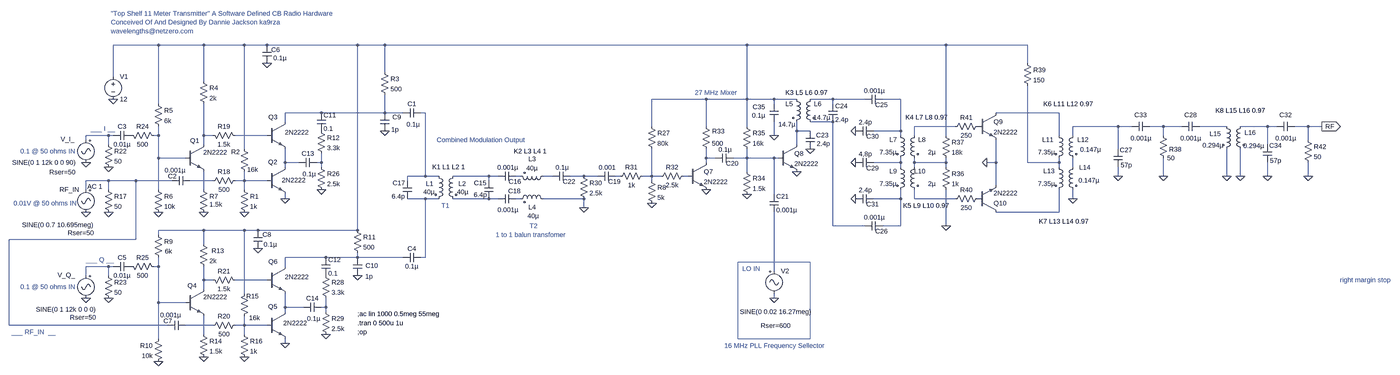
[diagram p0: schematic Top Shelf Transmitter.asc, whole sheet]
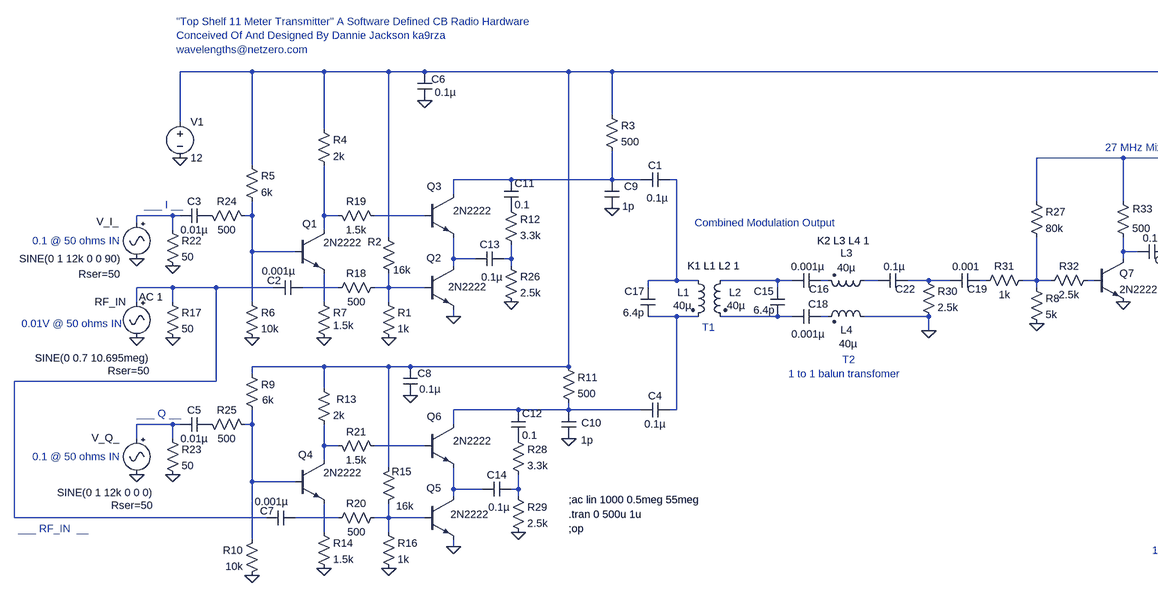
[diagram p1: schematic Top Shelf Transmitter.asc, part, row 1 of 1, column 1 of 2]
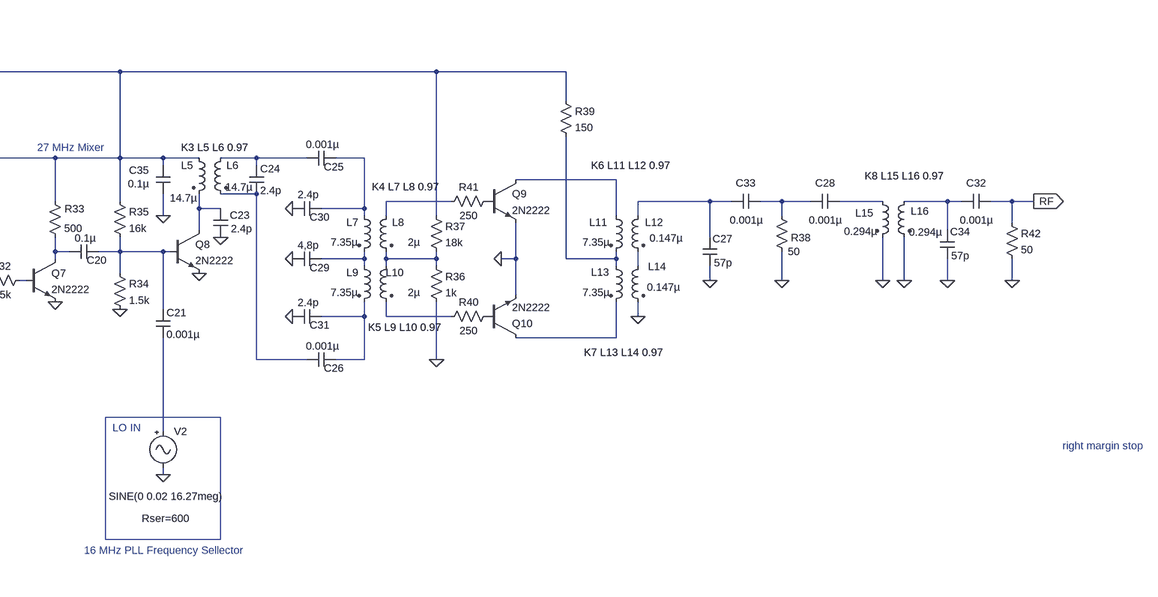
[diagram p2: schematic Top Shelf Transmitter.asc, part, row 1 of 1, column 2 of 2]
Top Shelf Transmitter.asc, the LTspice schematic file:
Version 4
SHEET 1 4188 1556
WIRE -192 352 -352 352
WIRE -32 352 -192 352
WIRE 112 352 -32 352
WIRE 192 352 112 352
WIRE 512 352 192 352
WIRE 608 352 512 352
WIRE 1888 352 608 352
WIRE 2592 352 1888 352
WIRE 2880 352 2592 352
WIRE 2880 416 2880 352
WIRE 608 448 608 352
WIRE -352 464 -352 352
WIRE -32 480 -32 352
WIRE 1744 544 1552 544
WIRE 1888 544 1888 352
WIRE 1888 544 1744 544
WIRE 1984 544 1888 544
WIRE 2064 544 1984 544
WIRE 2192 544 2112 544
WIRE 2304 544 2192 544
WIRE 2432 544 2368 544
WIRE -192 560 -192 352
WIRE 1984 560 1984 544
WIRE 2192 560 2192 544
WIRE 384 592 256 592
WIRE 608 592 608 528
WIRE 608 592 384 592
WIRE 672 592 608 592
WIRE 752 592 736 592
WIRE 2992 592 2768 592
WIRE 256 624 256 592
WIRE 2192 624 2112 624
WIRE 1552 640 1552 544
WIRE 1744 640 1744 544
WIRE 1888 640 1888 544
WIRE 2624 640 2480 640
WIRE 3200 640 3040 640
WIRE 3248 640 3200 640
WIRE 3360 640 3312 640
WIRE 3424 640 3360 640
WIRE 3584 640 3488 640
WIRE 3728 640 3632 640
WIRE 3760 640 3728 640
WIRE 3872 640 3824 640
WIRE 3920 640 3872 640
WIRE 2064 656 2064 624
WIRE 2112 656 2064 656
WIRE 2432 656 2432 544
WIRE 2432 656 2336 656
WIRE -368 672 -448 672
WIRE -352 672 -368 672
WIRE -192 672 -192 640
WIRE -192 672 -208 672
WIRE -32 672 -32 560
WIRE 0 672 -32 672
WIRE 192 672 80 672
WIRE 1984 672 1984 624
WIRE 2432 672 2432 656
WIRE 2480 672 2480 640
WIRE 2592 672 2592 352
WIRE 2992 672 2992 592
WIRE 3040 672 3040 640
WIRE 3360 672 3360 640
WIRE -448 688 -448 672
WIRE 3872 688 3872 640
WIRE -368 704 -368 672
WIRE -32 704 -32 672
WIRE 2064 704 2064 656
WIRE 3728 704 3728 640
WIRE 112 720 112 352
WIRE 3200 720 3200 640
WIRE -192 752 -192 672
WIRE -96 752 -192 752
WIRE 1744 752 1744 720
WIRE 1776 752 1744 752
WIRE 1888 752 1888 720
WIRE 1888 752 1840 752
WIRE 1984 752 1888 752
WIRE 2000 752 1984 752
WIRE 256 768 256 720
WIRE 304 768 256 768
WIRE 384 768 384 736
WIRE 384 768 368 768
WIRE 1744 768 1744 752
WIRE 2288 768 2272 768
WIRE 2432 768 2432 752
WIRE 2432 768 2336 768
WIRE 2480 768 2480 752
WIRE 2592 768 2592 752
WIRE 2592 768 2480 768
WIRE 2768 768 2768 688
WIRE 2768 768 2736 768
WIRE 2880 768 2880 496
WIRE 2992 768 2992 752
WIRE 2992 768 2880 768
WIRE 256 784 256 768
WIRE 384 784 384 768
WIRE 2432 784 2432 768
WIRE 2480 784 2480 768
WIRE 2592 784 2592 768
WIRE 2992 784 2992 768
WIRE 3040 784 3040 752
WIRE 1888 800 1888 752
WIRE 752 816 752 592
WIRE 752 816 688 816
WIRE 800 816 752 816
WIRE 976 816 848 816
WIRE 1008 816 976 816
WIRE 1088 816 1072 816
WIRE 1200 816 1168 816
WIRE 1312 816 1264 816
WIRE 1360 816 1312 816
WIRE 1440 816 1424 816
WIRE 1552 816 1552 720
WIRE 1552 816 1520 816
WIRE 1584 816 1552 816
WIRE 1680 816 1664 816
WIRE 3200 816 3200 784
WIRE 3360 816 3360 752
WIRE 3584 816 3584 720
WIRE 3632 816 3632 720
WIRE 3728 816 3728 768
WIRE 3872 816 3872 768
WIRE -368 832 -448 832
WIRE -272 832 -368 832
WIRE -144 832 -272 832
WIRE 0 832 -80 832
WIRE 112 832 112 800
WIRE 112 832 80 832
WIRE 192 832 112 832
WIRE 688 832 688 816
WIRE 976 832 976 816
WIRE 1552 832 1552 816
WIRE 2768 848 2768 768
WIRE -448 864 -448 832
WIRE -368 864 -368 832
WIRE -192 864 -192 752
WIRE -32 864 -32 800
WIRE 112 864 112 832
WIRE 1984 880 1984 752
WIRE 256 896 256 880
WIRE 752 896 688 896
WIRE 800 896 752 896
WIRE 976 896 976 880
WIRE 976 896 848 896
WIRE 1008 896 976 896
WIRE 1088 896 1072 896
WIRE 1312 896 1168 896
WIRE 2432 896 2432 864
WIRE 2432 896 2336 896
WIRE 2480 896 2480 864
WIRE 2624 896 2480 896
WIRE 3040 896 3040 864
WIRE 1312 928 1312 896
WIRE 2992 944 2992 864
WIRE 2992 944 2768 944
WIRE 2192 992 2192 624
WIRE 2304 992 2192 992
WIRE 2432 992 2432 896
WIRE 2432 992 2368 992
WIRE 2592 992 2592 864
WIRE -32 1008 -192 1008
WIRE 112 1008 -32 1008
WIRE 160 1008 112 1008
WIRE 512 1008 512 352
WIRE 512 1008 160 1008
WIRE -192 1024 -192 1008
WIRE -272 1040 -272 832
WIRE -272 1040 -720 1040
WIRE -32 1056 -32 1008
WIRE 400 1104 256 1104
WIRE 512 1104 512 1088
WIRE 512 1104 400 1104
WIRE 672 1104 512 1104
WIRE 752 1104 752 896
WIRE 752 1104 736 1104
WIRE -368 1136 -448 1136
WIRE -352 1136 -368 1136
WIRE -192 1136 -192 1104
WIRE -192 1136 -208 1136
WIRE 256 1136 256 1104
WIRE 1984 1152 1984 944
WIRE -448 1168 -448 1136
WIRE -368 1168 -368 1136
WIRE -32 1184 -32 1136
WIRE 0 1184 -32 1184
WIRE 192 1184 80 1184
WIRE -32 1216 -32 1184
WIRE 112 1232 112 1008
WIRE 1984 1248 1984 1232
WIRE -192 1264 -192 1136
WIRE -96 1264 -192 1264
WIRE 256 1280 256 1232
WIRE 320 1280 256 1280
WIRE 400 1280 400 1248
WIRE 400 1280 384 1280
WIRE 256 1296 256 1280
WIRE 400 1296 400 1280
WIRE -720 1344 -720 1040
WIRE -160 1344 -720 1344
WIRE 0 1344 -96 1344
WIRE 112 1344 112 1312
WIRE 112 1344 80 1344
WIRE 192 1344 112 1344
WIRE -32 1376 -32 1312
WIRE 112 1376 112 1344
WIRE -192 1392 -192 1264
WIRE 256 1408 256 1392
FLAG 256 896 0
FLAG 3920 640 RF
IOPIN 3920 640 Out
FLAG -352 544 0
FLAG -448 768 0
FLAG -448 944 0
FLAG -192 944 0
FLAG -32 944 0
FLAG 256 1408 0
FLAG -448 1248 0
FLAG -32 1456 0
FLAG 192 416 0
FLAG -192 1472 0
FLAG 112 944 0
FLAG 112 1456 0
FLAG -368 944 0
FLAG -368 784 0
FLAG -368 1248 0
FLAG 160 1072 0
FLAG 608 656 0
FLAG 512 1168 0
FLAG 1312 928 0
FLAG 400 1376 0
FLAG 384 864 0
FLAG 1552 912 0
FLAG 1744 864 0
FLAG 1888 880 0
FLAG 2064 800 0
FLAG 1984 1248 0
FLAG 2272 768 0
FLAG 2736 768 0
FLAG 2592 992 0
FLAG 3360 816 0
FLAG 2272 896 0
FLAG 2272 656 0
FLAG 3040 896 0
FLAG 3200 816 0
FLAG 3584 816 0
FLAG 3632 816 0
FLAG 3872 816 0
FLAG 3728 816 0
FLAG 2112 720 0
FLAG 1984 672 0
SYMBOL npn 192 784 R0
WINDOW 0 4 -18 Left 0
WINDOW 3 52 46 Left 0
SYMATTR InstName Q2
SYMATTR Value 2N2222
SYMBOL npn 192 624 R0
WINDOW 0 5 -17 Left 0
WINDOW 3 63 37 Left 0
SYMATTR InstName Q3
SYMATTR Value 2N2222
SYMBOL res 96 848 R0
SYMATTR InstName R1
SYMATTR Value 1k
SYMBOL res 96 704 R0
WINDOW 0 -31 26 Left 0
WINDOW 3 26 89 Left 0
SYMATTR InstName R2
SYMATTR Value 16k
SYMBOL res 592 432 R0
SYMATTR InstName R3
SYMATTR Value 500
SYMBOL cap 736 576 R90
WINDOW 0 0 32 VBottom 0
WINDOW 3 41 27 VTop 0
SYMATTR InstName C1
SYMATTR Value 0.1µ
SYMBOL voltage -352 448 R0
WINDOW 123 0 0 Left 0
WINDOW 39 0 0 Left 0
SYMATTR InstName V1
SYMATTR Value 12
SYMBOL cap -288 656 R90
WINDOW 0 0 32 VBottom 0
WINDOW 3 32 32 VTop 0
SYMATTR InstName C3
SYMATTR Value 0.01µ
SYMBOL npn -96 704 R0
WINDOW 0 16 -14 Left 0
WINDOW 3 63 28 Left 0
SYMATTR InstName Q1
SYMATTR Value 2N2222
SYMBOL res -48 464 R0
SYMATTR InstName R4
SYMATTR Value 2k
SYMBOL res -208 544 R0
SYMATTR InstName R5
SYMATTR Value 6k
SYMBOL res -208 848 R0
SYMATTR InstName R6
SYMATTR Value 10k
SYMBOL res -48 848 R0
WINDOW 3 36 68 Left 0
SYMATTR Value 1.5k
SYMATTR InstName R7
SYMBOL npn 192 1296 R0
WINDOW 0 4 -18 Left 0
WINDOW 3 57 40 Left 0
SYMATTR InstName Q5
SYMATTR Value 2N2222
SYMBOL npn 192 1136 R0
WINDOW 0 5 -17 Left 0
WINDOW 3 63 37 Left 0
SYMATTR InstName Q6
SYMATTR Value 2N2222
SYMBOL res 496 992 R0
SYMATTR InstName R11
SYMATTR Value 500
SYMBOL cap 736 1088 R90
WINDOW 0 0 32 VBottom 0
WINDOW 3 32 32 VTop 0
SYMATTR InstName C4
SYMATTR Value 0.1µ
SYMBOL cap -288 1120 R90
WINDOW 0 0 32 VBottom 0
WINDOW 3 32 32 VTop 0
SYMATTR InstName C5
SYMATTR Value 0.01µ
SYMBOL npn -96 1216 R0
WINDOW 0 7 -12 Left 0
WINDOW 3 63 28 Left 0
SYMATTR InstName Q4
SYMATTR Value 2N2222
SYMBOL res -48 1040 R0
WINDOW 0 44 40 Left 0
SYMATTR InstName R13
SYMATTR Value 2k
SYMBOL res -48 1360 R0
SYMATTR InstName R14
SYMATTR Value 1.5k
SYMBOL cap 176 352 R0
WINDOW 0 31 17 Left 0
WINDOW 3 38 46 Left 0
SYMATTR InstName C6
SYMATTR Value 0.1µ
SYMBOL Misc\\signal -448 672 M0
WINDOW 0 40 13 Left 0
WINDOW 3 35 96 Left 0
WINDOW 123 0 0 Left 0
WINDOW 39 37 130 Left 0
SYMATTR InstName V_I_
SYMATTR Value SINE(0 1 12k 0 0 90)
SYMATTR SpiceLine Rser=50
SYMBOL Misc\\signal -448 848 M0
WINDOW 3 -28 141 Left 0
WINDOW 123 -58 5 Left 0
WINDOW 39 -28 169 Left 0
SYMATTR Value SINE(0 0.7 10.695meg)
SYMATTR Value2 AC 1
SYMATTR SpiceLine Rser=50
SYMATTR InstName RF_IN
SYMBOL Misc\\signal -448 1152 M0
WINDOW 0 39 14 Left 0
WINDOW 3 -35 136 Left 0
WINDOW 123 0 0 Left 0
WINDOW 39 -35 164 Left 0
SYMATTR InstName V_Q_
SYMATTR Value SINE(0 1 12k 0 0 0)
SYMATTR SpiceLine Rser=50
SYMBOL res -208 1008 R0
WINDOW 3 39 74 Left 0
SYMATTR Value 6k
SYMATTR InstName R9
SYMBOL res -176 1376 M0
SYMATTR InstName R10
SYMATTR Value 10k
SYMBOL res 128 1216 M0
WINDOW 0 -35 25 Left 0
WINDOW 3 -39 102 Left 0
SYMATTR InstName R15
SYMATTR Value 16k
SYMBOL res 96 1360 R0
SYMATTR InstName R16
SYMATTR Value 1k
SYMBOL cap -96 1328 R90
WINDOW 0 16 63 VBottom 0
WINDOW 3 -36 53 VTop 0
SYMATTR InstName C7
SYMATTR Value 0.001µ
SYMBOL res 96 1328 R90
WINDOW 0 0 56 VBottom 0
WINDOW 3 32 56 VTop 0
SYMATTR InstName R20
SYMATTR Value 500
SYMBOL res 96 816 R90
WINDOW 0 0 56 VBottom 0
WINDOW 3 32 56 VTop 0
SYMATTR InstName R18
SYMATTR Value 500
SYMBOL res -384 848 R0
SYMATTR InstName R17
SYMATTR Value 50
SYMBOL cap -80 816 R90
WINDOW 0 16 63 VBottom 0
WINDOW 3 -36 53 VTop 0
SYMATTR InstName C2
SYMATTR Value 0.001µ
SYMBOL res 96 688 M270
WINDOW 0 32 56 VTop 0
WINDOW 3 0 56 VBottom 0
SYMATTR InstName R19
SYMATTR Value 1.5k
SYMBOL res 96 1200 M270
WINDOW 0 32 56 VTop 0
WINDOW 3 0 56 VBottom 0
SYMATTR InstName R21
SYMATTR Value 1.5k
SYMBOL res -384 688 R0
SYMATTR InstName R22
SYMATTR Value 50
SYMBOL res -384 1152 R0
SYMATTR InstName R23
SYMATTR Value 50
SYMBOL res -192 688 M270
WINDOW 0 32 56 VTop 0
WINDOW 3 0 56 VBottom 0
SYMATTR InstName R24
SYMATTR Value 500
SYMBOL res -192 1152 M270
WINDOW 0 32 56 VTop 0
WINDOW 3 0 56 VBottom 0
SYMATTR InstName R25
SYMATTR Value 500
SYMBOL cap 144 1008 R0
WINDOW 0 32 15 Left 0
WINDOW 3 36 50 Left 0
SYMATTR InstName C8
SYMATTR Value 0.1µ
SYMBOL cap 496 1104 R0
WINDOW 0 44 29 Left 0
WINDOW 3 43 67 Left 0
SYMATTR InstName C10
SYMATTR Value 1p
SYMBOL cap 592 592 R0
WINDOW 0 43 15 Left 0
WINDOW 3 39 59 Left 0
SYMATTR InstName C9
SYMATTR Value 1p
SYMBOL ind2 784 800 R0
WINDOW 0 -31 43 Left 0
WINDOW 3 -40 72 Left 0
SYMATTR InstName L1
SYMATTR Value 40µ
SYMATTR Type ind
SYMBOL ind2 864 800 M0
WINDOW 0 -31 43 Left 0
WINDOW 3 -40 72 Left 0
SYMATTR InstName L2
SYMATTR Value 40µ
SYMATTR Type ind
SYMBOL cap 368 592 R0
SYMATTR InstName C11
SYMATTR Value 0.1
SYMBOL cap 384 1104 R0
SYMATTR InstName C12
SYMATTR Value 0.1
SYMBOL res 368 640 R0
SYMATTR InstName R12
SYMATTR Value 3.3k
SYMBOL res 368 768 R0
SYMATTR InstName R26
SYMATTR Value 2.5k
SYMBOL res 384 1152 R0
SYMATTR InstName R28
SYMATTR Value 3.3k
SYMBOL res 384 1280 R0
SYMATTR InstName R29
SYMATTR Value 2.5k
SYMBOL cap 368 752 R90
WINDOW 0 0 32 VBottom 0
WINDOW 3 41 27 VTop 0
SYMATTR InstName C13
SYMATTR Value 0.1µ
SYMBOL cap 384 1264 R90
WINDOW 0 0 32 VBottom 0
WINDOW 3 41 27 VTop 0
SYMATTR InstName C14
SYMATTR Value 0.1µ
SYMBOL cap 704 832 M0
SYMATTR InstName C17
SYMATTR Value 6.4p
SYMBOL cap 992 832 M0
WINDOW 3 22 50 Left 0
SYMATTR Value 6.4p
SYMATTR InstName C15
SYMBOL cap 1072 800 R90
WINDOW 0 51 4 VBottom 0
WINDOW 3 -30 29 VTop 0
SYMATTR InstName C16
SYMATTR Value 0.001µ
SYMBOL ind2 1184 800 R90
WINDOW 0 -29 55 VBottom 0
WINDOW 3 -28 55 VTop 0
SYMATTR InstName L3
SYMATTR Value 40µ
SYMATTR Type ind
SYMBOL ind2 1184 912 M270
WINDOW 0 -30 55 VTop 0
WINDOW 3 -29 51 VBottom 0
SYMATTR InstName L4
SYMATTR Value 40µ
SYMATTR Type ind
SYMBOL cap 1072 880 R90
WINDOW 0 4 6 VBottom 0
WINDOW 3 40 28 VTop 0
SYMATTR InstName C18
SYMATTR Value 0.001µ
SYMBOL res 1536 816 R0
SYMATTR InstName R8
SYMATTR Value 5k
SYMBOL res 1536 624 R0
SYMATTR InstName R27
SYMATTR Value 80k
SYMBOL res 1536 800 R90
WINDOW 0 0 56 VBottom 0
WINDOW 3 32 56 VTop 0
SYMATTR InstName R31
SYMATTR Value 1k
SYMBOL cap 1424 800 R90
WINDOW 0 51 4 VBottom 0
WINDOW 3 -30 29 VTop 0
SYMATTR InstName C19
SYMATTR Value 0.001
SYMBOL res 1680 800 R90
WINDOW 0 0 56 VBottom 0
WINDOW 3 32 56 VTop 0
SYMATTR InstName R32
SYMATTR Value 2.5k
SYMBOL npn 1680 768 R0
SYMATTR InstName Q7
SYMATTR Value 2N2222
SYMBOL res 1728 624 R0
WINDOW 0 37 33 Left 0
SYMATTR InstName R33
SYMATTR Value 500
SYMBOL cap 1840 736 R90
WINDOW 0 51 4 VBottom 0
WINDOW 3 -30 29 VTop 0
SYMATTR InstName C20
SYMATTR Value 0.1µ
SYMBOL res 1872 784 R0
SYMATTR InstName R34
SYMATTR Value 1.5k
SYMBOL res 1872 624 R0
SYMATTR InstName R35
SYMATTR Value 16k
SYMBOL npn 2000 704 R0
SYMATTR InstName Q8
SYMATTR Value 2N2222
SYMBOL res 1296 800 R0
SYMATTR InstName R30
SYMATTR Value 2.5k
SYMBOL cap 1264 800 R90
WINDOW 0 51 4 VBottom 0
WINDOW 3 -30 29 VTop 0
SYMATTR InstName C22
SYMATTR Value 0.1µ
SYMBOL ind2 2048 528 R0
WINDOW 0 -24 32 Left 0
WINDOW 3 -49 105 Left 0
SYMATTR InstName L5
SYMATTR Value 14.7µ
SYMATTR Type ind
SYMBOL cap 1968 880 R0
SYMATTR InstName C21
SYMATTR Value 0.001µ
SYMBOL ind2 2128 528 M0
WINDOW 0 -24 32 Left 0
WINDOW 3 -55 81 Left 0
SYMATTR InstName L6
SYMATTR Value 14.7µ
SYMATTR Type ind
SYMBOL cap 2128 656 M0
WINDOW 0 -49 15 Left 0
WINDOW 3 -54 45 Left 0
SYMATTR InstName C23
SYMATTR Value 2.4p
SYMBOL Misc\\signal 1984 1136 R0
WINDOW 3 -121 160 Left 0
WINDOW 123 0 0 Left 0
WINDOW 39 -47 209 Left 0
SYMATTR Value SINE(0 0.02 16.27meg)
SYMATTR SpiceLine Rser=600
SYMATTR InstName V2
SYMBOL cap 2176 560 R0
SYMATTR InstName C24
SYMATTR Value 2.4p
SYMBOL cap 2368 528 R90
WINDOW 0 51 4 VBottom 0
WINDOW 3 -30 29 VTop 0
SYMATTR InstName C25
SYMATTR Value 0.001µ
SYMBOL cap 2368 976 R90
WINDOW 0 51 4 VBottom 0
WINDOW 3 -30 29 VTop 0
SYMATTR InstName C26
SYMATTR Value 0.001µ
SYMBOL ind2 2416 656 R0
WINDOW 0 -24 31 Left 0
WINDOW 3 -59 75 Left 0
SYMATTR InstName L7
SYMATTR Value 7.35µ
SYMATTR Type ind
SYMBOL ind2 2496 656 M0
WINDOW 0 -24 31 Left 0
WINDOW 3 -59 75 Left 0
SYMATTR InstName L8
SYMATTR Value 2µ
SYMATTR Type ind
SYMBOL ind2 2416 768 R0
WINDOW 0 -24 31 Left 0
WINDOW 3 -59 75 Left 0
SYMATTR InstName L9
SYMATTR Value 7.35µ
SYMATTR Type ind
SYMBOL ind2 2496 768 M0
WINDOW 0 -24 31 Left 0
WINDOW 3 -59 75 Left 0
SYMATTR InstName L10
SYMATTR Value 2µ
SYMATTR Type ind
SYMBOL res 2576 768 R0
SYMATTR InstName R36
SYMATTR Value 1k
SYMBOL res 2576 656 R0
SYMATTR InstName R37
SYMATTR Value 18k
SYMBOL npn 2704 592 R0
SYMATTR InstName Q9
SYMATTR Value 2N2222
SYMBOL npn 2704 944 M180
SYMATTR InstName Q10
SYMATTR Value 2N2222
SYMBOL ind2 2976 656 R0
WINDOW 0 -44 31 Left 0
WINDOW 3 -59 75 Left 0
SYMATTR InstName L11
SYMATTR Value 7.35µ
SYMATTR Type ind
SYMBOL ind2 3056 656 M0
WINDOW 0 -40 31 Left 0
WINDOW 3 -84 66 Left 0
SYMATTR InstName L12
SYMATTR Value 0.147µ
SYMATTR Type ind
SYMBOL ind2 2976 768 R0
WINDOW 0 -40 30 Left 0
WINDOW 3 -59 75 Left 0
SYMATTR InstName L13
SYMATTR Value 7.35µ
SYMATTR Type ind
SYMBOL ind2 3056 768 M0
WINDOW 0 -47 17 Left 0
WINDOW 3 -78 63 Left 0
SYMATTR InstName L14
SYMATTR Value 0.147µ
SYMATTR Type ind
SYMBOL cap 3184 720 R0
WINDOW 0 22 4 Left 0
WINDOW 3 25 57 Left 0
SYMATTR InstName C27
SYMATTR Value 57p
SYMBOL res 2864 400 R0
SYMATTR InstName R39
SYMATTR Value 150
SYMBOL res 2720 880 R90
WINDOW 0 0 56 VBottom 0
WINDOW 3 32 56 VTop 0
SYMATTR InstName R40
SYMATTR Value 250
SYMBOL res 2720 624 R90
WINDOW 0 0 56 VBottom 0
WINDOW 3 32 56 VTop 0
SYMATTR InstName R41
SYMATTR Value 250
SYMBOL cap 2336 752 R90
WINDOW 0 51 4 VBottom 0
WINDOW 3 -30 29 VTop 0
SYMATTR InstName C29
SYMATTR Value 4,8p
SYMBOL cap 2336 640 R90
WINDOW 0 51 4 VBottom 0
WINDOW 3 -30 29 VTop 0
SYMATTR InstName C30
SYMATTR Value 2.4p
SYMBOL cap 2336 880 R90
WINDOW 0 51 4 VBottom 0
WINDOW 3 -30 29 VTop 0
SYMATTR InstName C31
SYMATTR Value 2.4p
SYMBOL cap 3312 624 R90
WINDOW 0 -9 32 VBottom 0
WINDOW 3 42 31 VTop 0
SYMATTR InstName C33
SYMATTR Value 0.001µ
SYMBOL res 3344 656 R0
WINDOW 0 36 65 Left 0
WINDOW 3 29 96 Left 0
SYMATTR InstName R38
SYMATTR Value 50
SYMBOL cap 3488 624 R90
WINDOW 0 -9 32 VBottom 0
WINDOW 3 42 31 VTop 0
SYMATTR InstName C28
SYMATTR Value 0.001µ
SYMBOL ind2 3568 624 R0
WINDOW 0 -45 42 Left 0
WINDOW 3 -70 83 Left 0
SYMATTR InstName L15
SYMATTR Value 0.294µ
SYMATTR Type ind
SYMBOL ind2 3648 624 M0
WINDOW 0 -39 38 Left 0
WINDOW 3 -69 85 Left 0
SYMATTR InstName L16
SYMATTR Value 0.294µ
SYMATTR Type ind
SYMBOL cap 3824 624 R90
WINDOW 0 -9 32 VBottom 0
WINDOW 3 42 31 VTop 0
SYMATTR InstName C32
SYMATTR Value 0.001µ
SYMBOL res 3856 672 R0
SYMATTR InstName R42
SYMATTR Value 50
SYMBOL cap 3712 704 R0
WINDOW 0 22 4 Left 0
WINDOW 3 25 57 Left 0
SYMATTR InstName C34
SYMATTR Value 57p
SYMBOL cap 2000 560 M0
WINDOW 0 47 11 Left 0
WINDOW 3 47 41 Left 0
SYMATTR InstName C35
SYMATTR Value 0.1µ
TEXT 512 1368 Left 0 !;op
TEXT -360 240 Left 0 ;"Top Shelf 11 Meter Transmitter" A Software Defined CB Radio Hardware\nConceived Of And Designed By Dannie Jackson ka9rza\nwavelengths@netzero.com
TEXT 512 1336 Left 0 !.tran 0 500u 1u
TEXT -432 648 Left 0 ;___ I __
TEXT 792 688 Left 0 ;Combined Modulation Output
TEXT -448 1112 Left 0 ;___ Q __
TEXT -712 1368 Left 0 ;___ RF_IN  __
TEXT -704 912 Left 0 ;0.01V @ 50 ohms IN
TEXT -680 728 Left 0 ;0.1 @ 50 ohms IN
TEXT -680 1208 Left 0 ;0.1 @ 50 ohms IN
TEXT 512 1304 Left 0 !;ac lin 1000 0.5meg 55meg
TEXT 776 784 Left 0 !K1 L1 L2 1
TEXT 1000 1024 Left 0 ;1 to 1 balun transfomer
TEXT 808 920 Left 0 ;T1
TEXT 1064 728 Left 0 !K2 L3 L4 1
TEXT 1120 992 Left 0 ;T2
TEXT 3984 1184 Left 0 ;right margin stop
TEXT 2024 520 Left 0 !K3 L5 L6 0.97
TEXT 1872 1144 Left 0 ;LO IN
TEXT 1704 520 Left 0 ;27 MHz Mixer
TEXT 2448 608 Left 0 !K4 L7 L8 0.97
TEXT 2440 920 Left 0 !K5 L9 L10 0.97
TEXT 2936 560 Left 0 !K6 L11 L12 0.97
TEXT 2920 976 Left 0 !K7 L13 L14 0.97
TEXT 3544 584 Left 0 !K8 L15 L16 0.97
TEXT 1808 1416 Left 0 ;16 MHz PLL Frequency Sellector
RECTANGLE Normal 2112 1392 1856 1120

The netlist it stands for:
* Top Shelf Transmitter.asc
Q2 N020 N035 0 0 2N2222
Q3 N004 N017 N020 0 2N2222
R1 N035 0 1k
R2 N001 N035 16k
R3 N001 N004 500
C1 N005 N004 0.1µ
V1 N001 0 12
C3 P001 N014 0.01µ
Q1 N016 N015 N036 0 2N2222
R4 N001 N016 2k
R5 N001 N015 6k
R6 N015 0 10k
R7 N036 0 1.5k
Q5 N049 N052 0 0 2N2222
Q6 N043 N048 N049 0 2N2222
R11 N001 N043 500
C4 N037 N043 0.1µ
C5 P002 N044 0.01µ
Q4 N047 N045 N053 0 2N2222
R13 N001 N047 2k
R14 N053 0 1.5k
C6 N001 0 0.1µ
V_I_ N014 0 SINE(0 1 12k 0 0 90) Rser=50
V§RF_IN N033 0 SINE(0 0.7 10.695meg) AC 1 Rser=50
V_Q_ N044 0 SINE(0 1 12k 0 0 0) Rser=50
R9 N001 N045 6k
R10 N045 0 10k
R15 N001 N052 16k
R16 N052 0 1k
C7 N051 N033 0.001µ
R20 N052 N051 500
R18 N035 N034 500
R17 N033 0 50
C2 N034 N033 0.001µ
R19 N017 N016 1.5k
R21 N048 N047 1.5k
R22 N014 0 50
R23 N044 0 50
R24 N015 P001 500
R25 N045 P002 500
C8 N001 0 0.1µ
C10 N043 0 1p
C9 N004 0 1p
L1 N005 N037 40µ
L2 N026 N038 40µ
C11 N004 P003 0.1
C12 N043 P004 0.1
R12 P003 N021 3.3k
R26 N021 0 2.5k
R28 P004 N050 3.3k
R29 N050 0 2.5k
C13 N021 N020 0.1µ
C14 N050 N049 0.1µ
C17 N005 N037 6.4p
C15 N026 N038 6.4p
C16 N027 N026 0.001µ
L3 N028 N027 40µ
L4 0 N039 40µ
C18 N039 N038 0.001µ
R8 N031 0 5k
R27 N001 N031 80k
R31 N031 N030 1k
C19 N030 N029 0.001
R32 N032 N031 2.5k
Q7 N018 N032 0 0 2N2222
R33 N001 N018 500
C20 N019 N018 0.1µ
R34 N019 0 1.5k
R35 N001 N019 16k
Q8 N013 N019 0 0 2N2222
R30 N029 0 2.5k
C22 N029 N028 0.1µ
L5 N001 N013 14.7µ
C21 N019 N046 0.001µ
L6 N002 N007 14.7µ
C23 N013 0 2.4p
V2 N046 0 SINE(0 0.02 16.27meg) Rser=600
C24 N002 N007 2.4p
C25 N003 N002 0.001µ
C26 N040 N007 0.001µ
L7 N003 N022 7.35µ
L8 N008 N023 2µ
L9 N022 N040 7.35µ
L10 N023 N041 2µ
R36 N023 0 1k
R37 N001 N023 18k
Q9 N006 P005 0 0 2N2222
Q10 N042 P006 0 0 2N2222
L11 N006 N024 7.35µ
L12 N009 N025 0.147µ
L13 N024 N042 7.35µ
L14 N025 0 0.147µ
C27 N009 0 57p
R39 N001 N024 150
R40 P006 N041 250
R41 P005 N008 250
C29 N022 0 4,8p
C30 N003 0 2.4p
C31 N040 0 2.4p
C33 N010 N009 0.001µ
R38 N010 0 50
C28 N011 N010 0.001µ
L15 N011 0 0.294µ
L16 N012 0 0.294µ
C32 RF N012 0.001µ
R42 RF 0 50
C34 N012 0 57p
C35 N001 0 0.1µ
.model NPN NPN
.model PNP PNP
.lib standard.bjt
;op
* "Top Shelf 11 Meter Transmitter" A Software Defined CB Radio Hardware
* Conceived Of And Designed By Dannie Jackson ka9rza
* wavelengths@netzero.com
.tran 0 500u 1u
* ___ I __
* Combined Modulation Output
* ___ Q __
* ___ RF_IN  __
* 0.01V @ 50 ohms IN
* 0.1 @ 50 ohms IN
* 0.1 @ 50 ohms IN
;ac lin 1000 0.5meg 55meg
K1 L1 L2 1
* 1 to 1 balun transfomer
* T1
K2 L3 L4 1
* T2
* right margin stop
K3 L5 L6 0.97
* LO IN
* 27 MHz Mixer
K4 L7 L8 0.97
K5 L9 L10 0.97
K6 L11 L12 0.97
K7 L13 L14 0.97
K8 L15 L16 0.97
* 16 MHz PLL Frequency Sellector
.backanno
.end